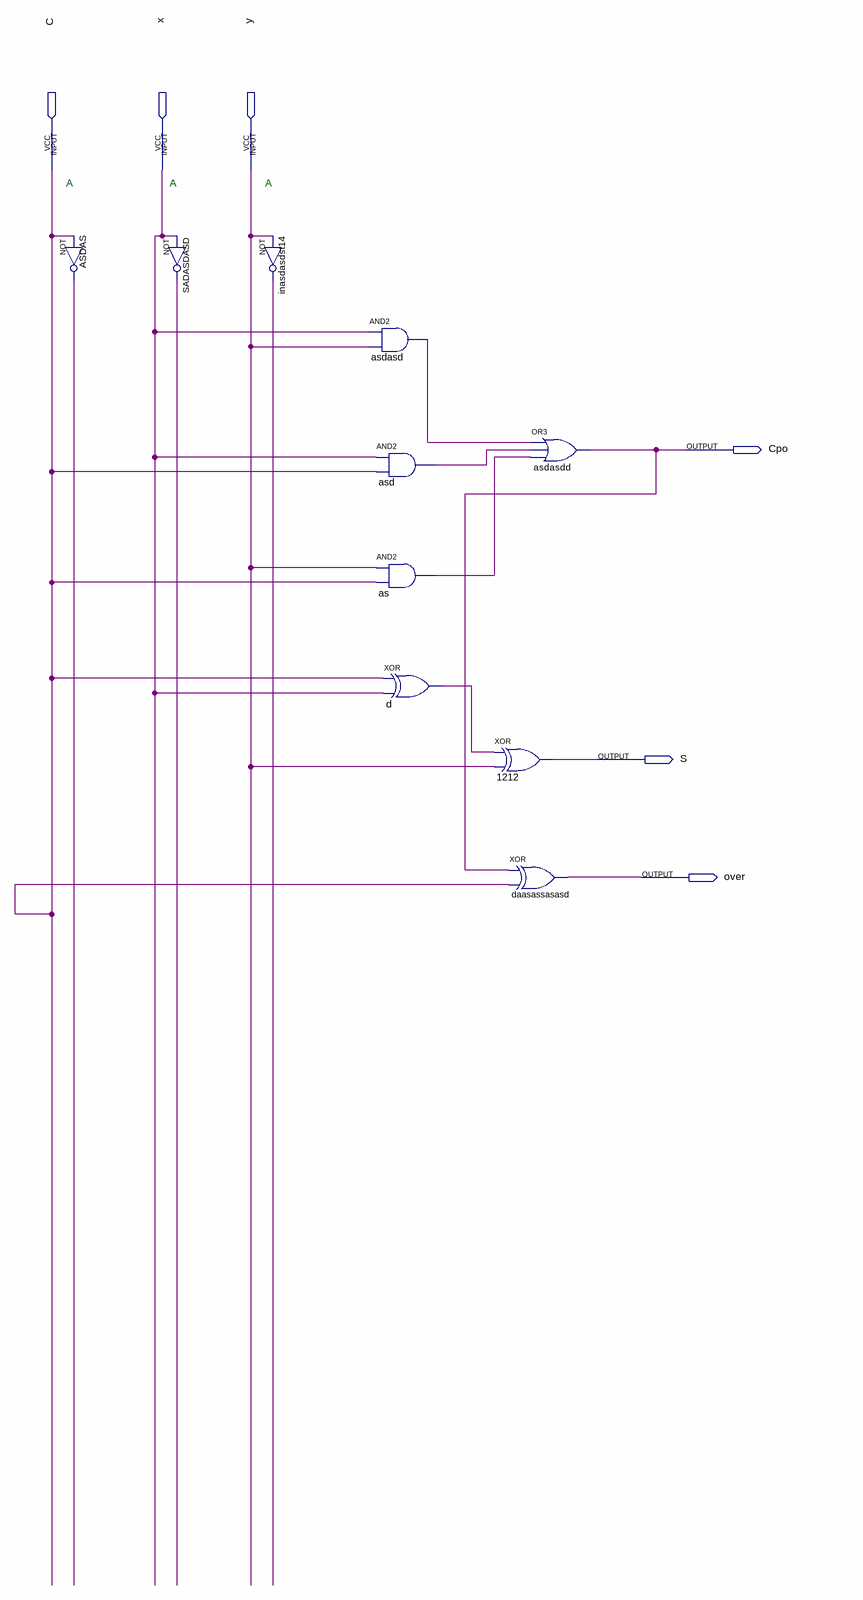
[diagram p0: schematic sheet]
// Quartus schematic designA.bdf as structural Verilog: 10 symbols, 6 pins
module designA (
  input  C,
  input  x,
  input  y,
  output Cpo,
  output S,
  output over
);

  wire as_out, asd_out, ASDAS_out, asdasd_out, d_out, inasdasdst14_out, SADASDASD_out;

  not ASDAS (ASDAS_out, C);
  not SADASDASD (SADASDASD_out, x);
  not inasdasdst14 (inasdasdst14_out, y);
  and asdasd (asdasd_out, x, y);
  and asd (asd_out, x, C);
  and as (as_out, y, C);
  xor d (d_out, C, x);
  xor u_1212 (S, d_out, y);
  xor daasassasasd (over, Cpo, C);
  or asdasdd (Cpo, asdasd_out, asd_out, as_out);

  // Notes on the sheet:
  //   A
  //   A
  //   A
endmodule
